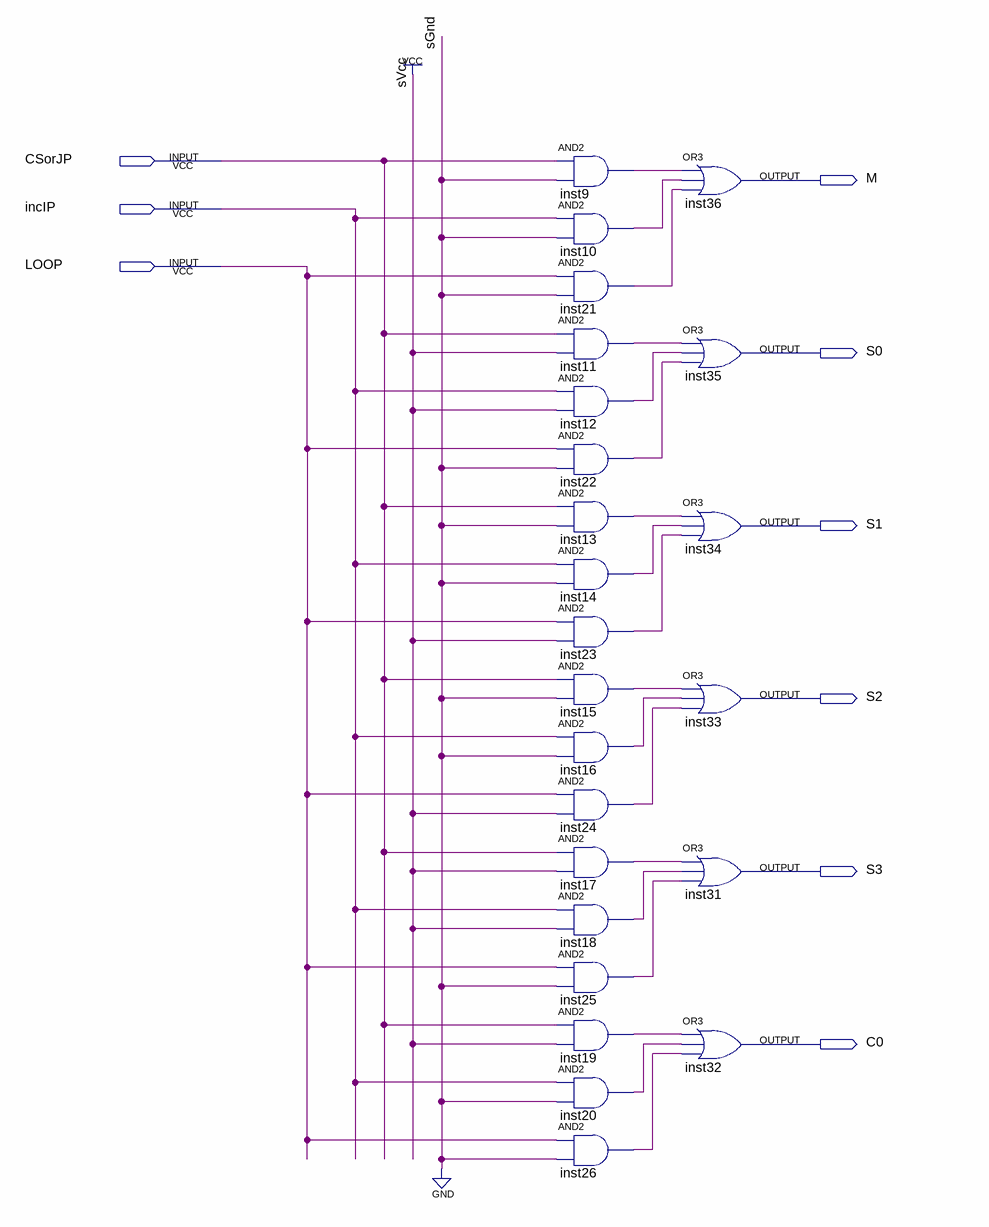
[diagram p0: schematic sheet]
// Quartus schematic MMUControler.bdf as structural Verilog: 24 symbols, 9 pins
module MMUControler (
  input  CSorJP,
  input  incIP,
  input  LOOP,
  output M,
  output S0,
  output S1,
  output S2,
  output S3,
  output C0
);

  wire inst9_out, inst10_out, inst11_out, inst12_out, inst13_out, inst14_out, inst15_out, inst16_out,
       inst17_out, inst18_out, inst19_out, inst20_out, inst21_out, inst22_out, inst23_out, inst24_out,
       inst25_out, inst26_out;

  and inst9 (inst9_out, CSorJP, 1'b0);
  and inst10 (inst10_out, incIP, 1'b0);
  and inst21 (inst21_out, LOOP, 1'b0);
  and inst11 (inst11_out, CSorJP, 1'b1);
  and inst12 (inst12_out, incIP, 1'b1);
  and inst22 (inst22_out, LOOP, 1'b0);
  and inst13 (inst13_out, CSorJP, 1'b0);
  and inst14 (inst14_out, incIP, 1'b0);
  and inst23 (inst23_out, LOOP, 1'b1);
  and inst15 (inst15_out, CSorJP, 1'b0);
  and inst16 (inst16_out, incIP, 1'b0);
  and inst24 (inst24_out, LOOP, 1'b1);
  and inst17 (inst17_out, CSorJP, 1'b1);
  and inst18 (inst18_out, incIP, 1'b1);
  and inst25 (inst25_out, LOOP, 1'b0);
  and inst19 (inst19_out, CSorJP, 1'b1);
  and inst20 (inst20_out, incIP, 1'b0);
  and inst26 (inst26_out, LOOP, 1'b0);
  or inst36 (M, inst9_out, inst10_out, inst21_out);
  or inst35 (S0, inst11_out, inst12_out, inst22_out);
  or inst34 (S1, inst13_out, inst14_out, inst23_out);
  or inst33 (S2, inst15_out, inst16_out, inst24_out);
  or inst31 (S3, inst17_out, inst18_out, inst25_out);
  or inst32 (C0, inst19_out, inst20_out, inst26_out);
endmodule
